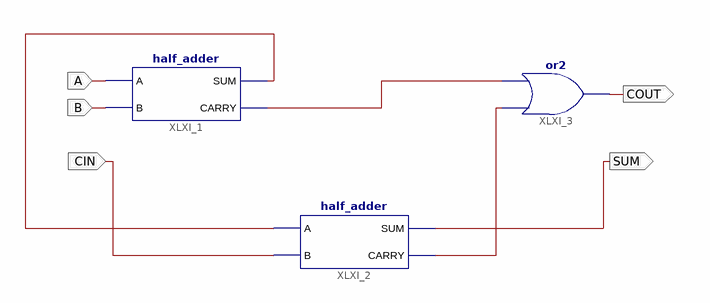
[diagram p0: schematic sheet 1]
// Xilinx ISE schematic full_adder.sch (zynq) as structural Verilog: 3 symbols, 5 ports
module full_adder (
  input  CIN,
  input  A,
  input  B,
  output COUT,
  output SUM
);

  wire XLXN_13, XLXN_15, XLXN_17;

  half_adder XLXI_1 (.A(A), .B(B), .SUM(XLXN_15), .CARRY(XLXN_17));
  half_adder XLXI_2 (.A(XLXN_15), .B(CIN), .SUM(SUM), .CARRY(XLXN_13));
  or XLXI_3 (COUT, XLXN_13, XLXN_17);
endmodule
